# Altium project LimeSDR-QPCIe_1v2.PrjPcb (part 8 of 13)

## Sheet 22_USB3_0_device.SchDoc: USB3.0 device
size A3; Organization: Lime Microsystems; Address1: Surrey Tech Centre; Address2: Guildford GU2 7YG; Address3: Surrey; Address4: United Kingdom; Revision: v1.2; SheetNumber: 20; SheetTotal: 27
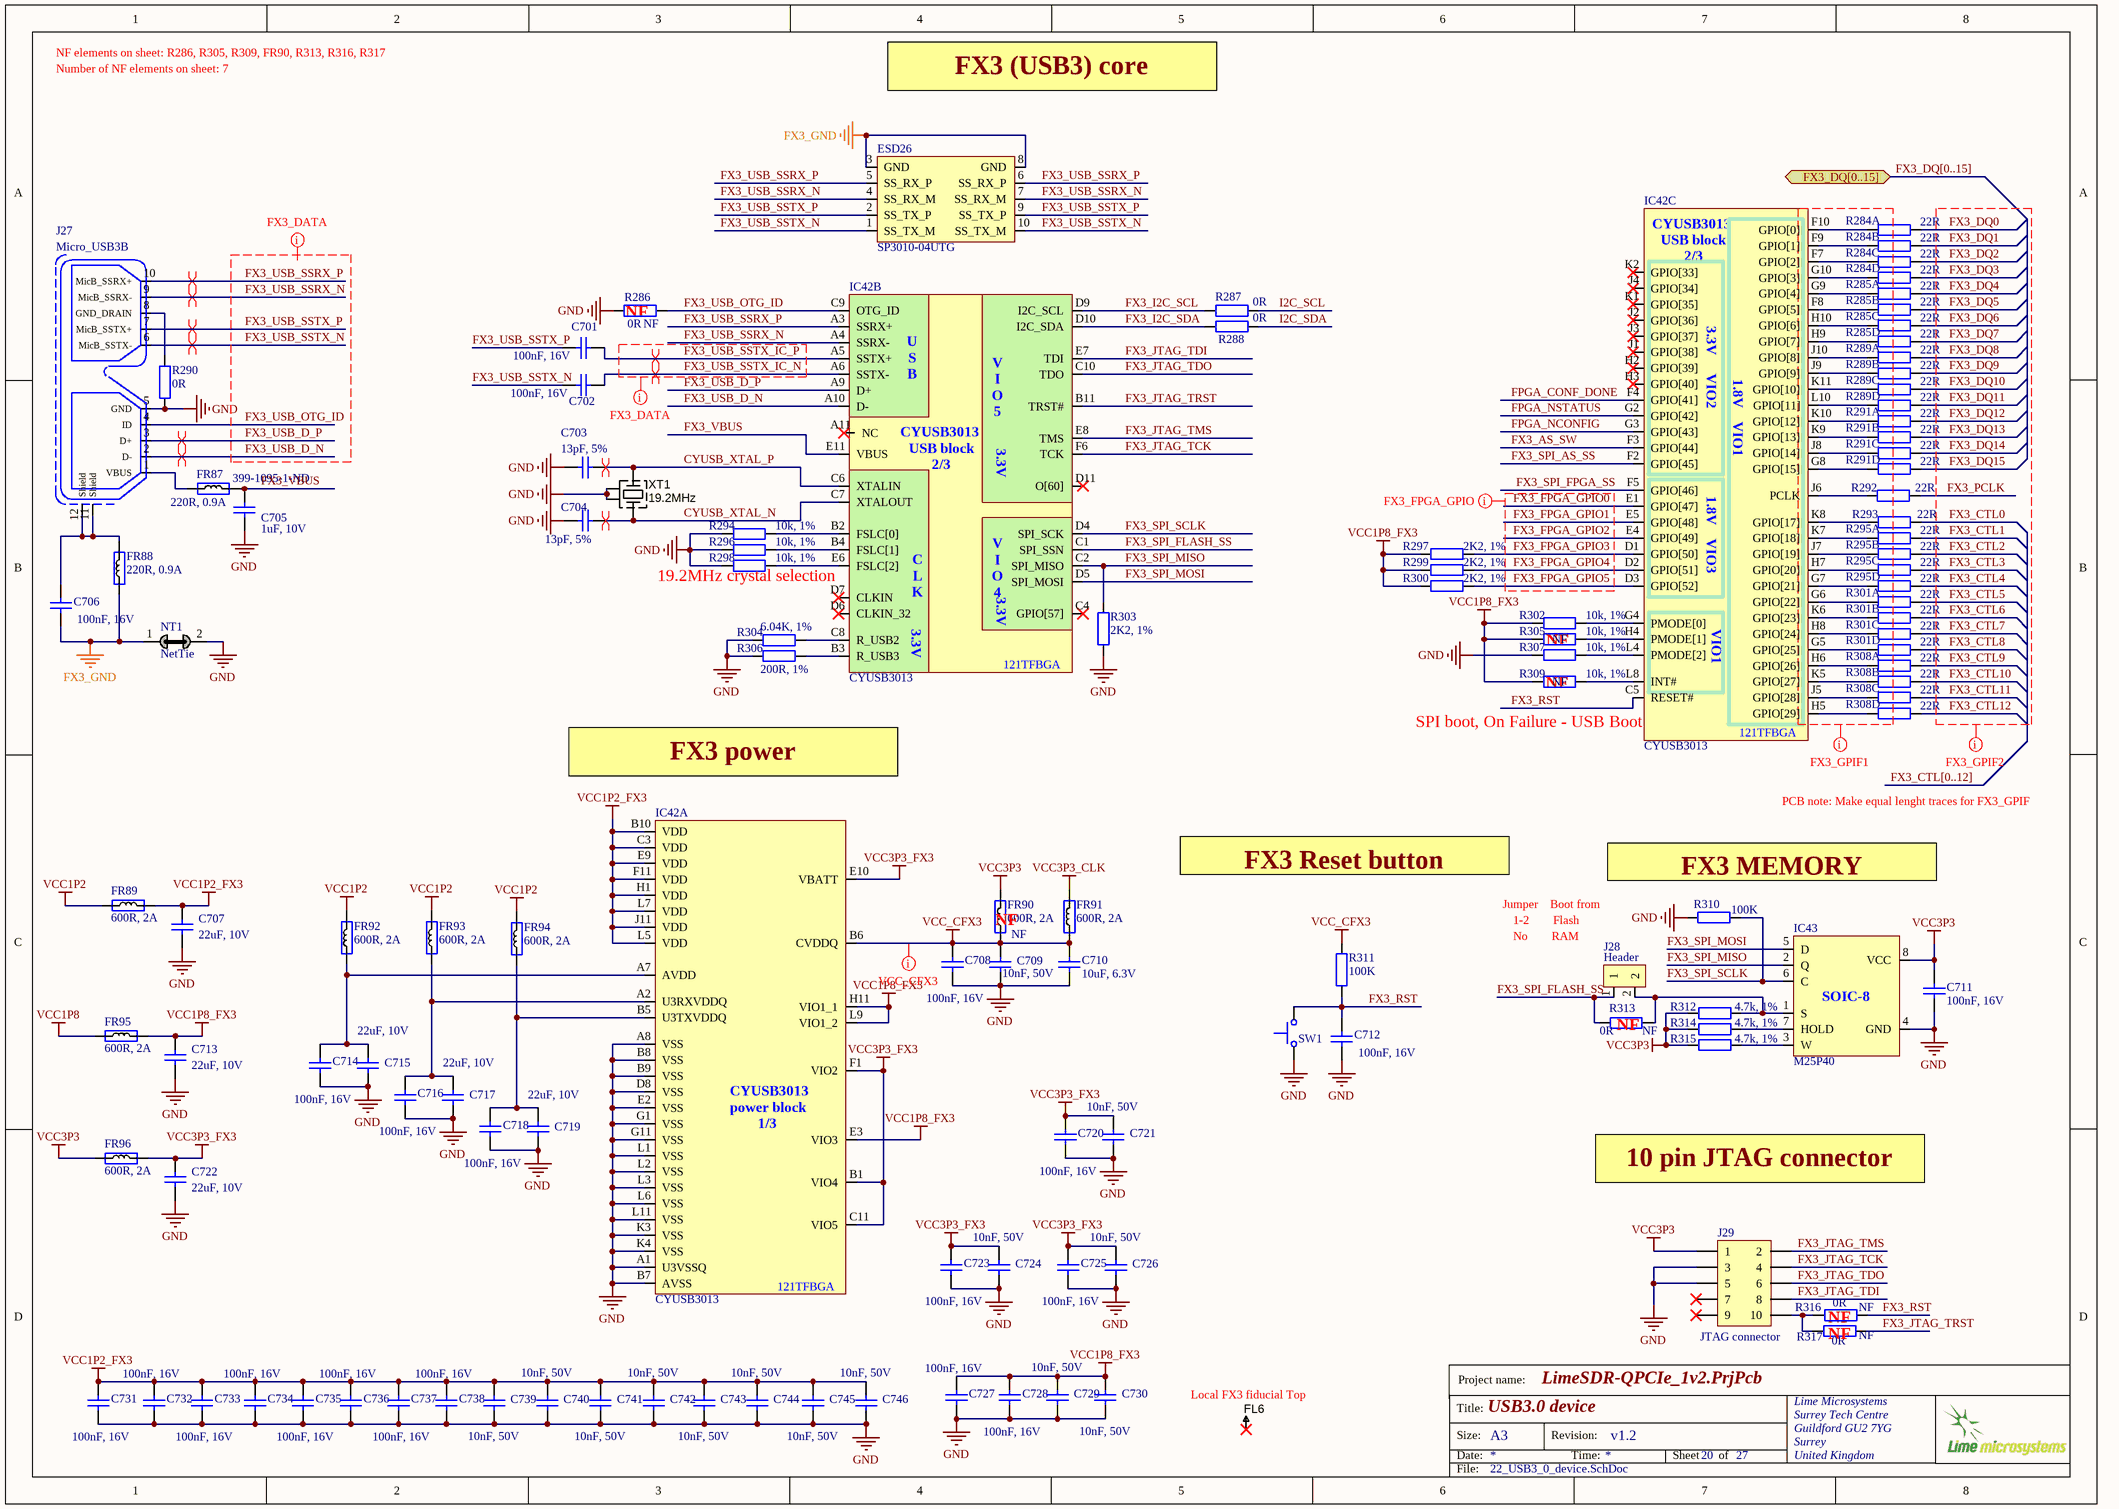
[diagram p21: 22_USB3_0_device.SchDoc]

### Parts
C701  100nF, 16V  [CAP0402]
C702  100nF, 16V  [CAP0402]
C703  13pF, 5%  [CAP0402]
C704  13pF, 5%  [CAP0402]
C705  1uF, 10V  Supplier Part Number 1: 399-1095-1-ND  [CAP0603]
C706  100nF, 16V  [CAP0402]
C707  22uF, 10V  [CAP0603]
C708  100nF, 16V  [CAP0402]
C709  10nF, 50V  [CAP0402]
C710  10uF, 6.3V  [CAP0603]
C711  100nF, 16V  [CAP0402]
C712  100nF, 16V  [CAP0402]
C713  22uF, 10V  [CAP0603]
C714  100nF, 16V  [CAP0402]
C715  22uF, 10V  [CAP0603]
C716  100nF, 16V  [CAP0402]
C717  22uF, 10V  [CAP0603]
C718  100nF, 16V  [CAP0402]
C719  22uF, 10V  [CAP0603]
C720  100nF, 16V  [CAP0402]
C721  10nF, 50V  [CAP0402]
C722  22uF, 10V  [CAP0603]
C723  100nF, 16V  [CAP0402]
C724  10nF, 50V  [CAP0402]
C725  100nF, 16V  [CAP0402]
C726  10nF, 50V  [CAP0402]
C727  100nF, 16V  [CAP0402]
C728  100nF, 16V  [CAP0402]
C729  10nF, 50V  [CAP0402]
C730  10nF, 50V  [CAP0402]
C731  100nF, 16V  [CAP0402]
C732  100nF, 16V  [CAP0402]
C733  100nF, 16V  [CAP0402]
C734  100nF, 16V  [CAP0402]
C735  100nF, 16V  [CAP0402]
C736  100nF, 16V  [CAP0402]
C737  100nF, 16V  [CAP0402]
C738  100nF, 16V  [CAP0402]
C739  10nF, 50V  [CAP0402]
C740  10nF, 50V  [CAP0402]
C741  10nF, 50V  [CAP0402]
C742  10nF, 50V  [CAP0402]
C743  10nF, 50V  [CAP0402]
C744  10nF, 50V  [CAP0402]
C745  10nF, 50V  [CAP0402]
C746  10nF, 50V  [CAP0402]
ESD26  SP3010-04UTG  [SP3010-04UTG]
FL6  Fiducial  [Fiducial_local]  (value not drawn)
FR87  220R, 0.9A  [RES0402]
FR88  220R, 0.9A  [RES0402]
FR89  600R, 2A  [RES0805]
FR90  600R, 2A  Assembly Info: NF  [RES0805]
FR91  600R, 2A  [RES0805]
FR92  600R, 2A  [RES0805]
FR93  600R, 2A  [RES0805]
FR94  600R, 2A  [RES0805]
FR95  600R, 2A  [RES0805]
FR96  600R, 2A  [RES0805]
IC42  CYUSB3013  [CYUSB3013]  (parts A,B,C of 3)
IC43  M25P40  [M25P40-VMN6TPB_SO8N]
J27  Micro_USB3B  [microUSB3B_SM_v2]
J28  Header  [HDR_1x2]
J29  JTAG connector  [SWD_10_pin]
NT1  NetTie  [NetTie_Wide2]  (net tie, no BOM)
R284  22R  [ChipResistorArray]  (parts A,B,C,D of 4)
R285  22R  [ChipResistorArray]  (parts A,B,C,D of 4)
R286  0R  Assembly Info: NF  [RES0402]
R287  0R  [RES0402]
R288  0R  [RES0402]
R289  22R  [ChipResistorArray]  (parts A,B,C,D of 4)
R290  0R  [RES0402]
R291  22R  [ChipResistorArray]  (parts A,B,C,D of 4)
R292  22R  [RES0402]
R293  22R  [RES0402]
R294  10k, 1%  [RES0402]
R295  22R  [ChipResistorArray]  (parts A,B,C,D of 4)
R296  10k, 1%  [RES0402]
R297  2K2, 1%  [RES0402]
R298  10k, 1%  [RES0402]
R299  2K2, 1%  [RES0402]
R300  2K2, 1%  [RES0402]
R301  22R  [ChipResistorArray]  (parts A,B,C,D of 4)
R302  10k, 1%  [RES0402]
R303  2K2, 1%  [RES0402]
R304  6.04K, 1%  [RES0402]
R305  10k, 1%  Assembly Info: NF  [RES0402]
R306  200R, 1%  [RES0402]
R307  10k, 1%  [RES0402]
R308  22R  [ChipResistorArray]  (parts A,B,C,D of 4)
R309  10k, 1%  Assembly Info: NF  [RES0402]
R310  100K  [RES0402]
R311  100K  [RES0402]
R312  4.7k, 1%  [RES0402]
R313  0R  Assembly Info: NF  [RES0402]
R314  4.7k, 1%  [RES0402]
R315  4.7k, 1%  [RES0402]
R316  0R  Assembly Info: NF  [RES0402]
R317  0R  Assembly Info: NF  [RES0402]
SW1  Switch, tactile  [SW_tactile]  (value not drawn)
XT1  19.2MHz  [CRYSTAL_4-LCC_v2]

### Ports
FX3_DQ[0..15] (bidir)

### Nets
FX3_GND: C706.2 ESD26.3(GND) ESD26.8(GND) FR88.1 NT1.1
GND: C703.1 C704.1 C705.1 C707.1 C708.2 C709.1 C710.1 C711.2 C712.2 C713.1 C714.2 C715.1 C716.2 C717.1 C718.2 C719.1 C720.2 C721.1 C722.1 C723.2 C724.1 C725.2 C726.1 C727.2 C728.2 C729.1 C730.1 C731.2 C732.2 C733.2 C734.2 C735.2 C736.2 C737.2 C738.2 C739.1 C740.1 C741.1 C742.1 C743.1 C744.1 C745.1 C746.1 IC42.A1(U3VSSQ) IC42.A8(VSS) IC42.B7(AVSS) IC42.B8(VSS) IC42.B9(VSS) IC42.D8(VSS) IC42.E2(VSS) IC42.G1(VSS) IC42.G11(VSS) IC42.K3(VSS) IC42.K4(VSS) IC42.L1(VSS) IC42.L2(VSS) IC42.L3(VSS) IC42.L6(VSS) IC42.L11(VSS) IC43.4(GND) J27.5(GND) J29.3 J29.5 NT1.2 R286.1 R290.1 R294.2 R296.2 R298.2 R303.2 R304.1 R306.1 R307.2 R310.1 SW1.1 XT1.2(GND) XT1.4(GND)
VCC1P2: FR89.1 FR92.2 FR93.2 FR94.2
VCC1P2_FX3: C707.2 C731.1 C732.1 C733.1 C734.1 C735.1 C736.1 C737.1 C738.1 C739.2 C740.2 C741.2 C742.2 C743.2 C744.2 C745.2 C746.2 FR89.2 IC42.B10(VDD) IC42.C3(VDD) IC42.E9(VDD) IC42.F11(VDD) IC42.H1(VDD) IC42.J11(VDD) IC42.L5(VDD) IC42.L7(VDD)
VCC1P8: FR95.1
VCC1P8_FX3: C713.2 C727.1 C728.1 C729.2 C730.2 FR95.2 IC42.E3(VIO3) IC42.H11(VIO1_1) IC42.L9(VIO1_2) R297.1 R299.1 R300.1 R302.2 R305.2 R309.2
VCC3P3: C711.1 FR90.2 FR96.1 IC43.8(VCC) J29.1 R312.2 R314.2 R315.2
VCC3P3_CLK: FR91.2
VCC3P3_FX3: C720.1 C721.2 C722.2 C723.1 C724.2 C725.1 C726.2 FR96.2 IC42.B1(VIO4) IC42.C11(VIO5) IC42.E10(VBATT) IC42.F1(VIO2)
VCC_CFX3: C708.1 C709.2 C710.2 FR90.1 FR91.1 IC42.B6(CVDDQ) R311.1
CYUSB_XTAL_N: C704.2 IC42.C7(XTALOUT) XT1.3(X)
CYUSB_XTAL_P: C703.2 IC42.C6(XTALIN) XT1.1(X)
FPGA_CONF_DONE: IC42.F4(GPIO[41])
FPGA_NCONFIG: IC42.G3(GPIO[43])
FPGA_NSTATUS: IC42.G2(GPIO[42])
FX3_AS_SW: IC42.F3(GPIO[44])
FX3_CTL0: R293.2
FX3_CTL1: R295.2
FX3_CTL2: R295.4
FX3_CTL3: R295.6
FX3_CTL4: R295.8
FX3_CTL5: R301.2
FX3_CTL6: R301.4
FX3_CTL7: R301.6
FX3_CTL8: R301.8
FX3_CTL9: R308.2
FX3_CTL10: R308.4
FX3_CTL11: R308.6
FX3_CTL12: R308.8
FX3_DQ0: R284.2
FX3_DQ1: R284.4
FX3_DQ2: R284.6
FX3_DQ3: R284.8
FX3_DQ4: R285.2
FX3_DQ5: R285.4
FX3_DQ6: R285.6
FX3_DQ7: R285.8
FX3_DQ8: R289.2
FX3_DQ9: R289.4
FX3_DQ10: R289.6
FX3_DQ11: R289.8
FX3_DQ12: R291.2
FX3_DQ13: R291.4
FX3_DQ14: R291.6
FX3_DQ15: R291.8
FX3_FPGA_GPIO0: IC42.E1(GPIO[47])
FX3_FPGA_GPIO1: IC42.E5(GPIO[48])
FX3_FPGA_GPIO2: IC42.E4(GPIO[49])
FX3_FPGA_GPIO3: IC42.D1(GPIO[50]) R297.2
FX3_FPGA_GPIO4: IC42.D2(GPIO[51]) R299.2
FX3_FPGA_GPIO5: IC42.D3(GPIO[52]) R300.2
FX3_I2C_SCL: IC42.D9(I2C_SCL) R287.2
FX3_I2C_SDA: IC42.D10(I2C_SDA) R288.2
FX3_JTAG_TCK: IC42.F6(TCK) J29.4
FX3_JTAG_TDI: IC42.E7(TDI) J29.8
FX3_JTAG_TDO: IC42.C10(TDO) J29.6
FX3_JTAG_TMS: IC42.E8(TMS) J29.2
FX3_JTAG_TRST: IC42.B11(TRST#) R317.1
FX3_PCLK: R292.2
FX3_RST: C712.1 IC42.C5(RESET#) R311.2 R316.1 SW1.2
FX3_SPI_AS_SS: IC42.F2(GPIO[45])
FX3_SPI_FLASH_SS: IC42.C1(SPI_SSN) J28.1 R313.1
FX3_SPI_FPGA_SS: IC42.F5(GPIO[46])
FX3_SPI_MISO: IC42.C2(SPI_MISO) IC43.2(Q) R303.1
FX3_SPI_MOSI: IC42.D5(SPI_MOSI) IC43.5(D)
FX3_SPI_SCLK: IC42.D4(SPI_SCK) IC43.6(C) R310.2
FX3_USB_D_N: IC42.A10(D-) J27.2(D-)
FX3_USB_D_P: IC42.A9(D+) J27.3(D+)
FX3_USB_OTG_ID: IC42.C9(OTG_ID) J27.4(ID) R286.2
FX3_USB_SSRX_N: ESD26.4(SS_RX_M) ESD26.7(SS_RX_M) IC42.A4(SSRX-) J27.9(MicB_SSRX-)
FX3_USB_SSRX_P: ESD26.5(SS_RX_P) ESD26.6(SS_RX_P) IC42.A3(SSRX+) J27.10(MicB_SSRX+)
FX3_USB_SSTX_IC_N: C702.2 IC42.A6(SSTX-)
FX3_USB_SSTX_IC_P: C701.1 IC42.A5(SSTX+)
FX3_USB_SSTX_N: C702.1 ESD26.1(SS_TX_M) ESD26.10(SS_TX_M) J27.6(MicB_SSTX-)
FX3_USB_SSTX_P: C701.2 ESD26.2(SS_TX_P) ESD26.9(SS_TX_P) J27.7(MicB_SSTX+)
FX3_VBUS: C705.2 FR87.2 IC42.E11(VBUS)
I2C_SCL: R287.1
I2C_SDA: R288.1
NetC706_1: C706.1 FR88.2 J27.11(Shield) J27.12(Shield)
NetC714_1: C714.1 C715.2 FR92.1 IC42.A7(AVDD)
NetC716_1: C716.1 C717.2 FR93.1 IC42.A2(U3RXVDDQ)
NetC718_1: C718.1 C719.2 FR94.1 IC42.B5(U3TXVDDQ)
NetFR87_1: FR87.1 J27.1(VBUS)
NetIC42_B2: IC42.B2(FSLC[0]) R294.1
NetIC42_B3: IC42.B3(R_USB3) R306.2
NetIC42_B4: IC42.B4(FSLC[1]) R296.1
NetIC42_C8: IC42.C8(R_USB2) R304.2
NetIC42_E6: IC42.E6(FSLC[2]) R298.1
NetIC42_F7: IC42.F7(GPIO[2]) R284.5
NetIC42_F8: IC42.F8(GPIO[5]) R285.3
NetIC42_F9: IC42.F9(GPIO[1]) R284.3
NetIC42_F10: IC42.F10(GPIO[0]) R284.1
NetIC42_G4: IC42.G4(PMODE[0]) R302.1
NetIC42_G5: IC42.G5(GPIO[25]) R301.7
NetIC42_G6: IC42.G6(GPIO[22]) R301.1
NetIC42_G7: IC42.G7(GPIO[21]) R295.7
NetIC42_G8: IC42.G8(GPIO[15]) R291.7
NetIC42_G9: IC42.G9(GPIO[4]) R285.1
NetIC42_G10: IC42.G10(GPIO[3]) R284.7
NetIC42_H4: IC42.H4(PMODE[1]) R305.1
NetIC42_H5: IC42.H5(GPIO[29]) R308.7
NetIC42_H6: IC42.H6(GPIO[26]) R308.1
NetIC42_H7: IC42.H7(GPIO[20]) R295.5
NetIC42_H8: IC42.H8(GPIO[24]) R301.5
NetIC42_H9: IC42.H9(GPIO[7]) R285.7
NetIC42_H10: IC42.H10(GPIO[6]) R285.5
NetIC42_J5: IC42.J5(GPIO[28]) R308.5
NetIC42_J6: IC42.J6(PCLK) R292.1
NetIC42_J7: IC42.J7(GPIO[19]) R295.3
NetIC42_J8: IC42.J8(GPIO[14]) R291.5
NetIC42_J9: IC42.J9(GPIO[9]) R289.3
NetIC42_J10: IC42.J10(GPIO[8]) R289.1
NetIC42_K5: IC42.K5(GPIO[27]) R308.3
NetIC42_K6: IC42.K6(GPIO[23]) R301.3
NetIC42_K7: IC42.K7(GPIO[18]) R295.1
NetIC42_K8: IC42.K8(GPIO[17]) R293.1
NetIC42_K9: IC42.K9(GPIO[13]) R291.3
NetIC42_K10: IC42.K10(GPIO[12]) R291.1
NetIC42_K11: IC42.K11(GPIO[10]) R289.5
NetIC42_L4: IC42.L4(PMODE[2]) R307.1
NetIC42_L8: IC42.L8(INT#) R309.1
NetIC42_L10: IC42.L10(GPIO[11]) R289.7
NetIC43_1: IC43.1(S) J28.2 R312.1 R313.2
NetIC43_3: IC43.3(W) R315.1
NetIC43_7: IC43.7(HOLD) R314.1
NetJ27_8: J27.8(GND_DRAIN) R290.2
NetJ29_10: J29.10 R316.2 R317.2

Not connected (* = marked no-connect by the designer): FL6 1*; IC42 A11(NC)* C4(GPIO[57])* D6(CLKIN_32)* D7(CLKIN)* D11(O[60])* H2(GPIO[39])* H3(GPIO[40])* J1(GPIO[38])* J2(GPIO[36])* J3(GPIO[37])* J4(GPIO[34])* K1(GPIO[35])* K2(GPIO[33])*; J29 7* 9*

### Buses and harness runs
bus FX3_CTL[0..12]
bus FX3_DQ[0..15] = port FX3_DQ[0..15]

### Layout directives
differential pair: CYUSB_XTAL_N, CYUSB_XTAL_P, FX3_USB_D_N, FX3_USB_D_P, FX3_USB_SSRX_N, FX3_USB_SSRX_P, FX3_USB_SSTX_IC_N, FX3_USB_SSTX_IC_P, FX3_USB_SSTX_N, FX3_USB_SSTX_P
net class FX3_DATA: FX3_USB_D_N, FX3_USB_D_P, FX3_USB_OTG_ID, FX3_USB_SSRX_N, FX3_USB_SSRX_P, FX3_USB_SSTX_IC_N, FX3_USB_SSTX_IC_P, FX3_USB_SSTX_N, FX3_USB_SSTX_P
net class FX3_GPIF1: (no net found under the mark)
net class FX3_FPGA_GPIO: FX3_FPGA_GPIO0, FX3_FPGA_GPIO1, FX3_FPGA_GPIO2, FX3_FPGA_GPIO3, FX3_FPGA_GPIO4, FX3_FPGA_GPIO5
net class FX3_GPIF2: FX3_CTL0, FX3_CTL1, FX3_CTL2, FX3_CTL3, FX3_CTL4, FX3_CTL5, FX3_CTL6, FX3_CTL7, FX3_CTL8, FX3_CTL9, FX3_CTL10, FX3_CTL11, FX3_CTL12, FX3_DQ0, FX3_DQ1, FX3_DQ2, FX3_DQ3, FX3_DQ4, FX3_DQ5, FX3_DQ6, FX3_DQ7, FX3_DQ8, FX3_DQ9, FX3_DQ10, FX3_DQ11, FX3_DQ12, FX3_DQ13, FX3_DQ14, FX3_DQ15, FX3_PCLK
net class VCC_CFX3: VCC_CFX3

### Notes on the sheet
- NF elements on sheet: R286, R305, R309, FR90, R313, R316, R317
- Number of NF elements on sheet: 7
- FX3 (USB3) core
- (near R286) NF
- (near IC42) VIO2
- (near IC42) 3.3V
- (near IC42) 1.8V
- (near IC42) VIO1
- 19.2MHz crystal selection
- (near IC42) VIO3
- (near R305) NF
- (near R309) NF
- FX3 power
- (near IC42) SPI boot, On Failure - USB Boot
- PCB note: Make equal lenght traces for FX3_GPIF
- (near FR90) NF
- FX3 Reset button
- Jumper    Boot from
- 1-2        Flash
- (near R310) FX3 MEMORY
- (near J28) No        RAM
- (near R313) NF
- 10 pin JTAG connector
- NF
- (near R317) NF
- (near FL6) Local FX3 fiducial Top
- Project name:
- Title:
- Size:
- Date:
- A3
- Revision:
- Time:
- Sheet
- of
- File:
- (in symbol CYUSB3013, part A) CYUSB3013 / power block / 1/3; 121TFBGA
- (in symbol CYUSB3013, part B) U / S / B; V / I / O / 5; CYUSB3013 / USB block / 2/3; C / L / K; V / I / O / 4; 121TFBGA
- (in symbol CYUSB3013, part C) CYUSB3013 / USB block / 2/3; 121TFBGA
- (in symbol M25P40) SOIC-8

### Library data of the parts
C701 C702 C706 C708 C711 C712 C714 C716 C718 C720 C723 C725 C727 C728 C731-C738 = Cap_0603: Part Description: 0.10µF ±10% 16V Ceramic Capacitor X7R 0402 (1005 Metric); Manufacturer Part Number 1: GRM155R71C104KA88D; Brand: Murata Electronics; Tolerance: 10 %; Type: General Purpose MLCC; Capacitance: 0.1 uF; Temperature Coefficient / Code: +/- 15 %; Case Height: 0.5 mm; Case Length: 1 mm; Dielectric: X7R; Supplier 1: Mouser; Supplier Part Number 1: 81-GRM155R71C104KA88; Case Code - in: 0402; Manufacturer: Murata Electronics; Category: Multilayer Ceramic Capacitors MLCC - SMD/SMT; Voltage Rating DC: 16 V; Value: 100nF, 16V; Case Code - mm: 1005; Case Width: 0.5 mm; Manufacturer Part Number: GRM155R71C104KA88D; Maximum Operating Temperature: + 125 C; Minimum Operating Temperature: - 55 C; Minimum Order Quantity: 1; Operating Temperature Range: - 55 C to + 125 C; Package / Case: 0402 (1005 metric); Packaging: Reel; Product: General Type MLCCs; Product Category: Low & Medium Capacitance SMD Ceramic Chip Capacitors; Reeling: True; RoHS - Mouser: Y; RoHS: RoHS Compliant; Series: GRM; Standard Pack Qty: 10000; Termination Style: SMD/SMT
C703 C704 = Cap_0603: Manufacturer: Murata Electronics North America; Manufacturer Part Number 1: GRM1555C1H130JA01D; Part Description: 13pF ±5% 50V Ceramic Capacitor C0G, NP0 0402 (1005 Metric); Capacitance: 13pF, 50V; Voltage - Rated: 50V; Supplier 1: Digi-Key; Supplier Part Number 1: 490-5925-2-ND; Tolerance: ±5%; Category: Capacitors; Package / Case: 0402 (1005 Metric); Value: 13pF, 5%
C705 = Cap_0603: Part Description: CAP CER 0.1UF 10V X7R 0603; Manufacturer: KEMET; Manufacturer Part Number 1: C0603C104K8RACTU; Capacitance: 0.1µF; Tolerance: ±10%; Temperature Coefficient: X7R; Supplier 1: Digi-Key; RoHS: RoHS Compliant; Category: Capacitors; Stock 1: 1223171; Pricing 1: 1=0.1, 10=0.028, 100=0.0125, 1000=0.00699 (USD); Packaging: Cut Tape (CT); Part Status: Active; Voltage - Rated: 10V; Operating Temperature: -55°C ~ 125°C; Features: -; Ratings: -; Applications: General Purpose; Failure Rate: -; Mounting Type: Surface Mount, MLCC; Package / Case: 0603 (1608 Metric); Size / Dimension: 0.063" L x 0.031" W (1.60mm x 0.80mm); Height - Seated (Max): -; Thickness (Max): 0.034" (0.87mm); Lead Spacing: -; Lead Style: -; ComponentLink1URL: http://www.kemet.com/docfinder?Partnumber=C0603C104K8RACTU; ComponentLink1Description: http://www.kemet.com/docfinder?Partnumber=C0603C104K8RACTU; value: 1uF, 10V
C707 C713 C715 C717 C719 C722 = Cap_0603: Manufacturer Part Number 1: C1608X5R1A226M080AC; Part Description: 22µF ±20% 10V Ceramic Capacitor X5R 0603 (1608 Metric); Manufacturer: TDK Corporation; Brand: TDK; Temperature Coefficient / Code: +/- 15 %; Tolerance: 20 %; Type: Multilayer Ceramic Chip Capacitor; Supplier 1: Mouser; Supplier Part Number 1: 810-C1608X5R1A226M; Package / Case: 0603 (1608 metric); Category: Multilayer Ceramic Capacitors MLCC - SMD/SMT; Capacitance: 22 uF; Operating Temperature Range: - 55 C to + 85 C; Case Code - in: 0603; Voltage Rating DC: 10 V; Case Code - mm: 1608; Value: 22uF, 10V
C709 C721 C724 C726 C729 C730 C739-C746 = Cap_0603: Part Description: 10000pF ±10% 50V Ceramic Capacitor X7R 0402 (1005 Metric); Manufacturer Part Number 1: CC0402KRX7R9BB103; Manufacturer: Yageo; Tolerance: ±10%; Capacitance: 10000pF; Supplier 1: Digi-Key; Supplier Part Number 1: 311-1349-2-ND; Category: Capacitors; Package / Case: 0402 (1005 Metric); Voltage - Rated: 50V; Value: 10nF, 50V
C710 = Cap_0603: Manufacturer Part Number 1: CC0603MRX5R5BB106; Part Description: 10µF ±20% 6.3V Ceramic Capacitor X5R 0603 (1608 Metric); Manufacturer: Yageo; Capacitance: 10µF; Tolerance: ±20%; Supplier 1: Digi-Key; Supplier Part Number 1: 311-1448-2-ND; Package / Case: 0603 (1608 Metric); Category: Capacitors; Voltage - Rated: 6.3V; Value: 10uF, 6.3V
ESD26 = SP3010-04UTG: Manufacturer: Littelfuse Inc; Part Description: TVS DIODE 6VWM 12.3VC UDFN; Supplier 1: Digi-Key; Category: Circuit Protection; Supplier Device Package: 10-µDFN (2.5x1.0); Supplier Part Number 1: F3507TR-ND; Manufacturer Part Number 1: SP3010-04UTG
FR87 = Ferrite: Manufacturer: TDK Corporation; Part Description: FERRITE BEAD 220 OHM 0402 1LN; Impedance @ Frequency: 220 Ohm @ 100MHz; Current Rating: 900mA; DC Resistance (DCR): 220 mOhm Max; Supplier 1: Digi-Key; Package / Case: 0402 (1005 Metric); Category: Filters; Supplier Part Number 1: 445-9329-2-ND; Value: 220R, 0.9A
FR88 = Ferrite: Manufacturer: TDK Corporation; Impedance @ Frequency: 220 Ohm @ 100MHz; Current Rating: 900mA; DC Resistance (DCR): 220 mOhm Max; Supplier 1: Digi-Key; Package / Case: 0402 (1005 Metric); Category: Filters; Supplier Part Number: 445-9329-2-ND; Value: 220R, 0.9A
FR89-FR96 = Ferrite: Manufacturer Part Number 1: MPZ2012S601A; Manufacturer: TDK; Part Description: FERRITE BEAD 600 OHM 0805 1LN; Impedance Tolerance: ± 25%; Impedance @ 100MHz: 600; Ferrite Mounting: SMD; DC Resistance Max: 0.1; DC Current Rating: 2; Ferrite Case Style: 0805 [2012 Metric]; DC Resistance (DCR): 100 mOhm Max; Filter Type: Differential Mode - Single; Impedance @ Frequency: 600 Ohm @ 100MHz; Supplier 1: Farnell; Supplier Part Number 1: 1669753RL; Supplier: Farnell; Core Material: Ferrite; Value: 600R, 2A; Category: Filters; Current Rating: 2A; Height (Max): 0.041" (1.05mm); Mounting Type: Surface Mount; Package / Case: 0805 (2012 Metric); Packaging: Tape & Reel (TR); RoHS: RoHS Compliant; Size / Dimension: 0.079" L x 0.049" W (2.00mm x 1.25mm)
IC42 = CYUSB3013: Cypress USB3.0 chip; Manufacturer Part Number 1: CYUSB3013-BZXC; Manufacturer: Cypress Semiconductor Corp; Part Description: IC ARM9 USB3 CONTROLLER 121FBGA; Voltage - Supply: 1.15 V ~ 1.25 V; Supplier 1: Digi-Key; Supplier Part Number 1: 428-3181-ND; Package / Case: 121-TFBGA
IC43 = M25P40: Manufacturer: Micron Technology Inc; Manufacturer Part Number 1: M25P40-VMN6TPB TR; Part Description: IC FLASH 4MBIT 75MHZ 8SO; Memory Size: 4M (512K x 8); Voltage - Supply: 2.3 V ~ 3.6 V; Supplier 1: Digi-Key; Supplier Device Package: 8-SO; Supplier: Digi-Key; Supplier Part Number 1: M25P40-VMN6TPBTR-ND
J27 = Micro_USB3_B: Manufacturer: Amphenol Commercial Products; Manufacturer Part Number 1: GSB443T33HR; Part Description: USB - micro B USB 3.1, Superspeed+ Receptacle Connector 10 Position Surface Mount, Right Angle, Horizontal; Connector Type: USB - micro B; Specifications: USB 3.1, Superspeed+; Gender: Receptacle; Number of Contacts: 10; Supplier 1: Digi-Key; Supplier Part Number 1: GSB443T33HRCT-ND; Category: Connectors, Interconnects; Features: Board Guide; Ingress Protection: -; RoHS: RoHS Compliant; Packaging: Cut Tape (CT); Mounting Type: Surface Mount, Right Angle, Horizontal
J28 = Jumper: Manufacturer Part Number 1: 961102-6404-AR; Part Description: 2 Positions Header, Unshrouded Connector 0.100" (2.54mm) Through Hole Gold; Manufacturer: 3M; Connector Type: Header, Unshrouded; Supplier 1: Digi-Key; Supplier Part Number 1: 3M9447-ND; Contact Type: Male Pin; Color: Black; Mounting Type: Through Hole; Category: Connectors, Interconnects; Contact Finish: Gold
J29 = Header 5X2_SWD: Header, 5-Pin, Dual row; Manufacturer Part Number 1: M50-3600542; Manufacturer: Harwin Inc; Part Description: 10 Position Header BTB Connector Gold 0.050" (1.27mm) Surface Mount; Number of Positions: 10; Molding Height Above Board: 0.039" (1.00mm); Row Spacing: 0.050" (1.27mm); Number of Positions Loaded: All; Connector Type: Unshrouded; Supplier 1: Digi-Key; Contact Mating Length: 0.118" (3.00mm); Category: Connectors, Interconnects; Color: Black; RoHS: RoHS Compliant; Number of Rows: 2; Contact Finish Thickness: 3µin (0.08µm); Height Stacking (Mating): -; Contact Finish: Gold; Termination: Solder; Mounting Type: Surface Mount; Pitch: 0.050" (1.27mm); Features: -; Packaging: Bulk; Supplier Part Number 1: 952-1389-ND
R284 R285 R289 R291 R295 R301 R308 = ResArray_0802: Part Description: RES ARRAY 4 RES 22 OHM 0804; Manufacturer Part Number 1: YC124-JR-0722RL; Manufacturer: Yageo; Temperature Coefficient: ±200ppm/°C; Tolerance: ±5%; Supplier 1: Digi-Key; Supplier Part Number 1: YC124J-22TR-ND; Package / Case: 0804, Convex, Long Side Terminals; Value: 22R
R286-R288 R290 = Res_0402: Manufacturer: Yageo; Part Description: RES SMD 0.0OHM JUMPER 1/16W 0402; Manufacturer Part Number 1: RC0402JR-070RL; Supplier 1: Digi-Key; Supplier Part Number 1: 311-0.0JRTR-ND; Composition: Thick Film; Package / Case: 0402 (1005 Metric); Category: Resistors; Value: 0R
R292 R293 = Res_0402: Part Description: RES SMD 22 OHM 1% 1/16W 0402; Manufacturer Part Number 1: RC0402FR-0722RL; Manufacturer: Yageo; Tolerance: ±1%; Temperature Coefficient: ±100ppm/°C; Resistance (Ohms): 22; Supplier 1: Digi-Key; Supplier Part Number 1: 311-22.0LRTR-ND; Supplier Device Package: 0402; Composition: Thick Film; Category: Resistors; Value: 22R
R294 R296 R298 R302 R305 R307 R309 = Res_0402: Manufacturer: Yageo; Manufacturer Part Number 1: RC0402FR-0710KL; Part Description: RES SMD 10K OHM 1% 1/16W 0402; Temperature Coefficient: ±100ppm/°C; Power (Watts): 0.063W, 1/16W; Value: 10k, 1%; Supplier 1: Digi-Key; Supplier Part Number 1: 311-10.0KLRTR-ND; Resistance (Ohms): 10k; Packaging: Tape & Reel (TR); RoHS: RoHS Compliant; Package / Case: 0402 (1005 Metric); Tolerance: ±1%; Operating Temperature: -55°C ~ 155°C; Size / Dimension: 0.039" L x 0.020" W (1.00mm x 0.50mm); Number of Terminations: 2; Category: Resistors; Height: 0.016" (0.40mm); Supplier Device Package: 0402; Features: Moisture Resistant; Composition: Thick Film
R297 R299 R300 R303 = Res_0402: Part Description: RES SMD 2.2K OHM 1% 1/16W 0402; Manufacturer Part Number 1: RMCF0402FT2K20; Resistance (Ohms): 2.2k; Temperature Coefficient: ±100ppm/°C; Supplier 1: Digi-Key; Supplier Part Number 1: RMCF0402FT2K20CT-ND; Height: 0.016" (0.40mm); Tolerance: ±1%; Composition: Thick Film; Package / Case: 0402 (1005 Metric); Category: Resistors; Value: 2K2, 1%
R304 = Res_0402: Manufacturer: Rohm Semiconductor; Manufacturer Part Number 1: MCR01MRTF6041; Part Description: RES SMD 6.04K OHM 1% 1/16W 0402; Temperature Coefficient: ±100ppm/°C; Supplier Part Number 1: RHM6.04KCDTR-ND; Supplier 1: Digi-Key; Category: Resistors; Supplier Device Package: 0402 (1005 Metric); Composition: Thick Film; Tolerance: ±1%; Value: 6.04K, 1%
R306 = Res_0402: Manufacturer: Stackpole Electronics Inc; Part Description: RES SMD 200 OHM 1% 1/16W 0402; Power (Watts): 0.063W, 1/16W; Resistance (Ohms): 200; Temperature Coefficient: ±100ppm/°C; Supplier 1: Digi-Key; Supplier Device Package: 0402; Composition: Thick Film; Category: Resistors; Tolerance: ±1%; Supplier Part Number 1: RMCF0402FT200RDKR-ND; Value: 200R, 1%
R310 = Res_0402: Manufacturer Part Number 1: ERJ-2GEJ104X; Manufacturer: Panasonic Electronic Components; Part Description: RES SMD 100K OHM 5% 1/10W 0402; Power (Watts): 0.1W, 1/10W; Tolerance: ±5%; Temperature Coefficient: ±200ppm/°C; Supplier 1: Digi-Key; Composition: Thick Film; Package / Case: 0402 (1005 Metric); Resistance (Ohms): 100k; Category: Resistors; Supplier Part Number 1: P100KJCT-ND; Value: 100K; Features: Automotive AEC-Q200; Height: 0.016" (0.40mm); Number of Terminations: 2; Operating Temperature: -55°C ~ 155°C; Packaging: Cut Tape (CT); RoHS: RoHS Compliant; Size / Dimension: 0.039" L x 0.020" W (1.00mm x 0.50mm); Supplier Device Package: 0402
R311 = Res_0402: Manufacturer: Panasonic Electronic Components; Manufacturer Part Number 1: ERJ-2GEJ104X; Part Description: RES SMD 100K OHM 5% 1/10W 0402; Power (Watts): 0.1W, 1/10W; Tolerance: ±5%; Temperature Coefficient: ±200ppm/°C; Supplier 1: Digi-Key; Composition: Thick Film; Package / Case: 0402 (1005 Metric); Resistance (Ohms): 100k; Category: Resistors; Supplier Part Number 1: P100KJCT-ND; Value: 100K; Features: Automotive AEC-Q200; Height: 0.016" (0.40mm); Number of Terminations: 2; Operating Temperature: -55°C ~ 155°C; Packaging: Cut Tape (CT); RoHS: RoHS Compliant; Size / Dimension: 0.039" L x 0.020" W (1.00mm x 0.50mm); Supplier Device Package: 0402
R312 R314 R315 = Res_0402: Manufacturer: Yageo; Part Description: RES SMD 4.7K OHM 1% 1/16W 0402; Manufacturer Part Number1: RC0402FR-074K7L; Temperature Coefficient: ±100ppm/°C; Power (Watts): 0.063W, 1/16W; Number of Terminations: 2; Category: Resistors; Supplier 1: Digi-Key; Height: 0.016" (0.40mm); Features: Moisture Resistant; Size / Dimension: 0.039" L x 0.020" W (1.00mm x 0.50mm); Supplier Device Package: 0402; RoHS: RoHS Compliant; Composition: Thick Film; Package / Case: 0402 (1005 Metric); Resistance (Ohms): 4.7k; Operating Temperature: -55°C ~ 155°C; Tolerance: ±1%; Supplier Part Number 1: 311-4.7KLRCT-ND; Packaging: Cut Tape (CT); Value: 4.7k, 1%
R313 R316 R317 = Res_0402: Manufacturer Part Number 1: RC0402JR-070RL; Manufacturer: Yageo; Part Description: RES SMD 0.0OHM JUMPER 1/16W 0402; Resistance (Ohms): 0.0; Tolerance: Jumper; Power (Watts): 0.063W, 1/16W; Value: 0R; Supplier 1: Digi-Key; Supplier Part Number 1: 311-0.0JRTR-ND; Category: Resistors; Temperature Coefficient: -; Features: Moisture Resistant; Supplier Device Package: 0402; Height: 0.016" (0.40mm); Package / Case: 0402 (1005 Metric); Operating Temperature: -55°C ~ 155°C; Size / Dimension: 0.039" L x 0.020" W (1.00mm x 0.50mm); Composition: Thick Film; Packaging: Tape & Reel (TR); Number of Terminations: 2; RoHS: RoHS Compliant
SW1 = Button: Part Description: Tactile Switch SPST-NO Top Actuated Surface Mount; Manufacturer Part Number 1: B3U-1000P; Manufacturer: Omron Electronics Inc-EMC Div; Outline: 3.00mm x 2.50mm; Actuator Type: Standard; Mechanical Life: 200,000 Cycles; Actuator Orientation: Top Actuated; Supplier 1: Digi-Key; Supplier Part Number 1: SW1020TR-ND; Category: Switches
XT1 = CRYSTAL_19M2: Oscillator Crystal 19.2 MHz; Manufacturer Part Number 1: 405C35B19M20000; Manufacturer: CTS-Frequency Controls; Part Description: 19.2MHz ±30ppm Crystal 13pF 60 Ohm -20°C ~ 70°C Surface Mount 4-SMD, No Lead (DFN, LCC); Frequency Tolerance: ±30ppm; ESR (Equivalent Series Resistance): 60 Ohm; Load Capacitance: 13pF; Frequency Stability: ±50ppm; Operating Mode: Fundamental; Supplier 1: Digi-Key; Supplier Part Number 1: CTX648CT-ND; Height: 0.041" (1.05mm); Category: Crystals and Oscillators; Package / Case: 4-SMD, No Lead (DFN, LCC); Mounting Type: Surface Mount; Operating Temperature: -20°C ~ 70°C; Size / Dimension: 0.197" L x 0.126" W (5.00mm x 3.20mm); Frequency: 19.2MHz

## Sheet 23_PCIe.SchDoc: PCI Express x4
size A4; Organization: Lime Microsystems; Address1: Surrey Tech Centre; Address2: Guildford GU2 7YG; Address3: Surrey; Address4: United Kingdom; Revision: v1.2; SheetNumber: 21; SheetTotal: 27
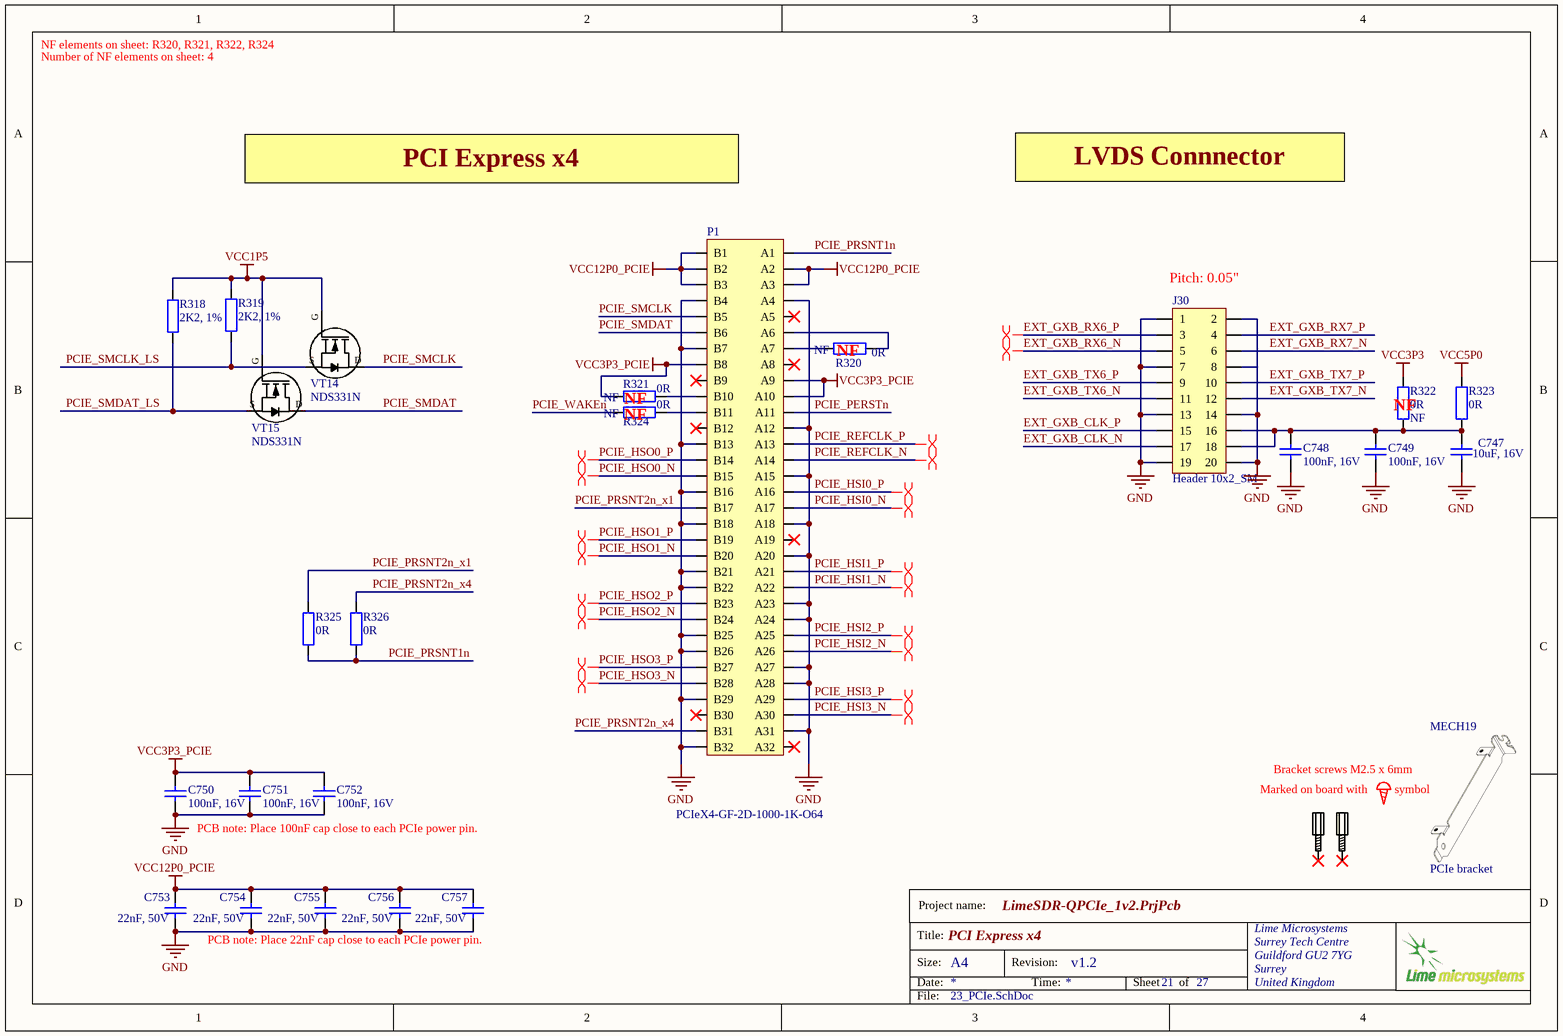
[diagram p22: 23_PCIe.SchDoc]

### Parts
C747  10uF, 16V  [CAP0603]
C748  100nF, 16V  [CAP0402]
C749  100nF, 16V  [CAP0402]
C750  100nF, 16V  [CAP0402]
C751  100nF, 16V  [CAP0402]
C752  100nF, 16V  [CAP0402]
C753  22nF, 50V  [CAP0402]
C754  22nF, 50V  [CAP0402]
C755  22nF, 50V  [CAP0402]
C756  22nF, 50V  [CAP0402]
C757  22nF, 50V  [CAP0402]
J30  Header 10x2_SM  [HEADER_10x2_SM_HALF_PITCH]
MECH19  PCIe bracket  [PCIe_bracket]
MECH20  Spacer M3  [PCIe_bracket_screw_M2.5]  (value not drawn)
MECH21  Spacer M3  [PCIe_bracket_screw_M2.5]  (value not drawn)
P1  PCIeX4-GF-2D-1000-1K-O64  [PCIeX4-GF-2D-1000-1K-O64]  (no BOM)
R318  2K2, 1%  [RES0402]
R319  2K2, 1%  [RES0402]
R320  0R  Assembly Info: NF  [RES0402]
R321  0R  Assembly Info: NF  [RES0402]
R322  0R  Assembly Info: NF  [RES0402]
R323  0R  [RES0402]
R324  0R  Assembly Info: NF  [RES0402]
R325  0R  [RES0402]
R326  0R  [RES0402]
VT14  NDS331N  [SOT23-3]
VT15  NDS331N  [SOT23-3]

### Nets
GND: C747.1 C748.2 C749.2 C750.2 C751.2 C752.2 C753.2 C754.2 C755.2 C756.2 C757.2 J30.1 J30.2 J30.7 J30.8 J30.13 J30.14 J30.19 J30.20 P1.A4 P1.A12 P1.A15 P1.A18 P1.A20 P1.A23 P1.A24 P1.A27 P1.A28 P1.A31 P1.B4 P1.B7 P1.B13 P1.B16 P1.B18 P1.B21 P1.B22 P1.B25 P1.B26 P1.B29 P1.B32
VCC1P5: R318.1 R319.1 VT14.G VT15.G
VCC3P3: R322.1
VCC3P3_PCIE: C750.1 C751.1 C752.1 P1.A9 P1.A10 P1.B8 R321.1
VCC5P0: R323.1
VCC12P0_PCIE: C753.1 C754.1 C755.1 C756.1 C757.1 P1.A2 P1.A3 P1.B1 P1.B2 P1.B3
EXT_GXB_CLK_N: J30.17
EXT_GXB_CLK_P: J30.15
EXT_GXB_RX6_N: J30.5
EXT_GXB_RX6_P: J30.3
EXT_GXB_RX7_N: J30.6
EXT_GXB_RX7_P: J30.4
EXT_GXB_TX6_N: J30.11
EXT_GXB_TX6_P: J30.9
EXT_GXB_TX7_N: J30.12
EXT_GXB_TX7_P: J30.10
PCIE_HSI0_N: P1.A17
PCIE_HSI0_P: P1.A16
PCIE_HSI1_N: P1.A22
PCIE_HSI1_P: P1.A21
PCIE_HSI2_N: P1.A26
PCIE_HSI2_P: P1.A25
PCIE_HSI3_N: P1.A30
PCIE_HSI3_P: P1.A29
PCIE_HSO0_N: P1.B15
PCIE_HSO0_P: P1.B14
PCIE_HSO1_N: P1.B20
PCIE_HSO1_P: P1.B19
PCIE_HSO2_N: P1.B24
PCIE_HSO2_P: P1.B23
PCIE_HSO3_N: P1.B28
PCIE_HSO3_P: P1.B27
PCIE_PERSTn: P1.A11
PCIE_PRSNT1n: P1.A1 R325.1 R326.1
PCIE_PRSNT2n_x1: P1.B17 R325.2
PCIE_PRSNT2n_x4: P1.B31 R326.2
PCIE_REFCLK_N: P1.A14
PCIE_REFCLK_P: P1.A13
PCIE_SMCLK: P1.B5 VT14.D
PCIE_SMCLK_LS: R319.2 VT14.S
PCIE_SMDAT: P1.B6 VT15.D
PCIE_SMDAT_LS: R318.2 VT15.S
PCIE_WAKEn: R324.1
NetC747_2: C747.2 C748.1 C749.1 J30.16 J30.18 R322.2 R323.2
NetP1_A6: P1.A6 R320.2
NetP1_A7: P1.A7 R320.1
NetP1_B10: P1.B10 R321.2
NetP1_B11: P1.B11 R324.2

Not connected (* = marked no-connect by the designer): MECH20 MH1*; MECH21 MH1*; P1 A5* A8* A19* A32* B9* B12* B30*

### Layout directives
differential pair: EXT_GXB_RX6_N, EXT_GXB_RX6_P, PCIE_HSI0_N, PCIE_HSI0_P, PCIE_HSI1_N, PCIE_HSI1_P, PCIE_HSI2_N, PCIE_HSI2_P, PCIE_HSI3_N, PCIE_HSI3_P, PCIE_HSO0_N, PCIE_HSO0_P, PCIE_HSO1_N, PCIE_HSO1_P, PCIE_HSO2_N, PCIE_HSO2_P, PCIE_HSO3_N, PCIE_HSO3_P, PCIE_REFCLK_N, PCIE_REFCLK_P

### Notes on the sheet
- NF elements on sheet: R320, R321, R322, R324
- Number of NF elements on sheet: 4
- PCI Express x4
- LVDS Connnector
- (near J30) Pitch: 0.05"
- (near R320) NF
- (near R324) NF
- (near R321) NF
- (near R322) NF
- (near MECH19) Bracket screws M2.5 x 6mm
- PCB note: Place 100nF cap close to each PCIe power pin.
- Marked on board with         symbol
- PCB note: Place 22nF cap close to each PCIe power pin.
- Project name:
- Title:
- Size:
- Date:
- A4
- Revision:
- Time:
- Sheet
- of
- File:

### Library data of the parts
C747 = Cap_0603: Manufacturer: Yageo; Manufacturer Part Number 1: GRM188R61C106MA73D; Part Description: 10µF ±20% 16V Ceramic Capacitor X5R 0603 (1608 Metric); Temperature Coefficient: X5R; Capacitance: 10µF; Tolerance: ±20%; Value: 10uF, 16V; Supplier 1: Digi-Key; Supplier Part Number 1: 490-7201-2-ND; Category: Capacitors; Ratings: -; Features: -; Lead Style: -; Package / Case: 0603 (1608 Metric); Lead Spacing: -; Applications: General Purpose; Voltage - Rated: 16V; Operating Temperature: -55°C ~ 85°C; Thickness (Max): 0.039" (1.00mm); Mounting Type: Surface Mount, MLCC; RoHS: RoHS Compliant; Size / Dimension: 0.063" L x 0.031" W (1.60mm x 0.80mm); Packaging: Tape & Reel (TR); Height - Seated (Max): -
C748 C749 = Cap_0603: Manufacturer Part Number 1: GRM155R71C104KA88D; Part Description: 0.10µF ±10% 16V Ceramic Capacitor X7R 0402 (1005 Metric); Brand: Murata Electronics; Tolerance: 10 %; Type: General Purpose MLCC; Capacitance: 0.1 uF; Temperature Coefficient / Code: +/- 15 %; Case Height: 0.5 mm; Case Length: 1 mm; Dielectric: X7R; Supplier 1: Mouser; Supplier Part Number 1: 81-GRM155R71C104KA88; Case Code - in: 0402; Manufacturer: Murata Electronics; Category: Multilayer Ceramic Capacitors MLCC - SMD/SMT; Voltage Rating DC: 16 V; Value: 100nF, 16V; Manufacturer Part Number: GRM155R71C104KA88D; Case Code - mm: 1005; Case Width: 0.5 mm; Maximum Operating Temperature: + 125 C; Minimum Operating Temperature: - 55 C; Minimum Order Quantity: 1; Operating Temperature Range: - 55 C to + 125 C; Package / Case: 0402 (1005 metric); Packaging: Reel; Product: General Type MLCCs; Product Category: Low & Medium Capacitance SMD Ceramic Chip Capacitors; Reeling: True; RoHS - Mouser: Y; RoHS: RoHS Compliant; Series: GRM; Standard Pack Qty: 10000; Termination Style: SMD/SMT
C750-C752 = Cap_0603: as C701 on sheet 22_USB3_0_device; Supplier 1: Mouser; Supplier Part Number 1: 81-GRM155R71C104KA88; Case Code - in: 0402; Manufacturer: Murata Electronics; Category: Multilayer Ceramic Capacitors MLCC - SMD/SMT; Voltage Rating DC: 16 V; Value: 100nF, 16V; Case Code - mm: 1005; Case Width: 0.5 mm; Manufacturer Part Number: GRM155R71C104KA88D; Maximum Operating Temperature: + 125 C; Minimum Operating Temperature: - 55 C; Minimum Order Quantity: 1; Operating Temperature Range: - 55 C to + 125 C; Package / Case: 0402 (1005 metric); Packaging: Reel; Product: General Type MLCCs; Product Category: Low & Medium Capacitance SMD Ceramic Chip Capacitors; Reeling: True; RoHS - Mouser: Y; RoHS: RoHS Compliant; Series: GRM; Standard Pack Qty: 10000; Termination Style: SMD/SMT
C753-C757 = Cap_0402: Manufacturer: Kemet; Manufacturer Part Number 1: C0402C223K5RACTU; Part Description: 0.022µF ±10% 50V Ceramic Capacitor X7R 0402 (1005 Metric); Temperature Coefficient: X7R; Tolerance: ±10%; Capacitance: 0.022µF; Value: 22nF, 50V; Supplier 1: Digi-Key; Supplier Part Number 1: 399-7780-1-ND; Ratings: -; Packaging: Cut Tape (CT); Category: Capacitors; Size / Dimension: 0.039" L x 0.020" W (1.00mm x 0.50mm); RoHS: RoHS Compliant; Operating Temperature: -55°C ~ 125°C; Mounting Type: Surface Mount, MLCC; Applications: General Purpose; Voltage - Rated: 50V; Thickness (Max): 0.022" (0.55mm); Features: -; Height - Seated (Max): -; Lead Style: -; Package / Case: 0402 (1005 Metric); Lead Spacing: -
J30 = Header 10x2_SM: Manufacturer: Amphenol FCI; Manufacturer Part Number 1: 20021121-00020C4LF; Part Description: 20 Positions Header Connector 0.050" (1.27mm) Surface Mount Gold; Pitch - Mating: 0.050" (1.27mm); Style: Board to Board; Shrouding: Unshrouded; Number of Positions: 20; Number of Positions Loaded: All; Contact Length - Mating: 0.120" (3.05mm); Material Flammability Rating: UL94 V-0; Supplier 1: Digi-Key; RoHS: RoHS Compliant; Category: Connectors, Interconnects; Stock 1: 7468; Pricing 1: 1=1.49, 10=1.351, 100=1.1582 (USD); Packaging: Cut Tape (CT); Part Status: Active; Connector Type: Header; Contact Type: Male Pin; Number of Rows: 2; Row Spacing - Mating: 0.050" (1.27mm); Mounting Type: Surface Mount; Termination: Solder; Fastening Type: Push-Pull; Contact Length - Post: -; Overall Contact Length: -; Insulation Height: -; Contact Shape: Square; Contact Finish - Mating: Gold; Contact Finish Thickness - Mating: 10µin (0.25µm); Contact Finish - Post: Tin; Contact Material: Copper Alloy; Insulation Material: Thermoplastic; Features: Pick and Place; Operating Temperature: -; Ingress Protection: -; Insulation Color: Black; Current Rating: -; Voltage Rating: -; Mated Stacking Heights: -; Contact Finish Thickness - Post: 50µin (1.27µm); Applications: -; ComponentLink1URL: http://portal.fciconnect.com/Comergent//fci/drawing/20021121.pdf; ComponentLink1Description: http://portal.fciconnect.com/Comergent//fci/drawing/20021121.pdf; Supplier Part Number 1: 609-3698-1-ND
MECH19 = PCIe_bracket: Manufacturer: Keystone Electronics; Manufacturer Part Number 1: 9203; Part Description: BRACKET, COMPUTER, PCI,LENGTH 120mm, HOLE TO HOLE DISTANCE 85.4mm; Card Type: PCI; Style: Blank; Supplier 1: Digi-Key; RoHS: RoHS Compliant; Category: Computers, Office - Components, Accessories; Stock 1: 5093; Pricing 1: 1=3.31, 10=2.083, 50=1.87, 100=1.785, 250=1.615, 1000=1.44, 2500=1.28001, 5000=1.1305 (USD); Part Status: Active; Material: Steel, Nickel Plated; ComponentLink1URL: http://www.keyelco.com/product-pdf.cfm?p=2468; ComponentLink1Description: http://www.keyelco.com/product-pdf.cfm?p=2468; Supplier Part Number 1: 36-9203-ND
MECH20 MECH21 = STANDOFF_M-F_THREADED_M3x8x10mm_HEX_5mm dia: STANDOFF M/F MET 5MM HEX 10MM L; Part Description: The M2.56 PRA2MCS100- is a M2.5 x 6mm Machine Screw, made of 18/8 stainless steel (A2 grade) with self colour finish, cross-recessed pan head Pozidriv head style. Designed according to DIN 7985 standard. Corrosion resistant under normal atmospheric conditions.; Manufacturer: DURATOOL; Manufacturer Part Number 1: M2.56 PRA2MCS100-; Thread Size - Metric: M2.5; Fastener Material: Stainless Steel; Screw Length: 6; Screw Head Style: Pan Head Pozidriv; SVHC: No SVHC (12-Jan-2017); Driver Type: Pozi; Thread Size: M2.5<!--FANDB--><div class="features-and-benefits-container"><div class="features-and-benefits-description"><span class="features-benefits-value">The M2.56 PRA2MCS100- is a M2.5 x 6mm Machine Screw, made of 18/8 stainless steel (A2 grade) with self colour finish, cross-recessed pan head Pozidriv head style. Designed according to DIN 7985 standard. Corrosion resistant under normal atmospheric conditions.</span></div><div class="features-and-benefits-list"><ul class="features-and-benefits-list-list"><li class="features-and-benefits-list-item">5; Supplier 1: Farnell; Supplier Part Number 1: 1420030; RoHS: YES; Stock 1: 256; Pricing 1: 100=0.0542, 10000=0.0503, 25000=0.0477, 50000=0.0467 (GBP); Thread Size - Imperial: -; Fastener Plating: -; Product Range: -; External Length / Height: 6; Material: Stainless Steel; ComponentLink1URL: http://www.farnell.com/datasheets/1661804.pdf; ComponentLink1Description: http://www.farnell.com/datasheets/1661804.pdf
R318 R319 = Res_0402: as R297 on sheet 22_USB3_0_device; Supplier 1: Digi-Key; Supplier Part Number 1: RMCF0402FT2K20CT-ND; Height: 0.016" (0.40mm); Tolerance: ±1%; Composition: Thick Film; Package / Case: 0402 (1005 Metric); Category: Resistors; Value: 2K2, 1%
R320 R321 R324-R326 = Res_0402: as R286 on sheet 22_USB3_0_device; Supplier 1: Digi-Key; Supplier Part Number 1: 311-0.0JRTR-ND; Composition: Thick Film; Package / Case: 0402 (1005 Metric); Category: Resistors; Value: 0R
R322 R323 = Res_0402: as R313 on sheet 22_USB3_0_device; Value: 0R; Supplier 1: Digi-Key; Supplier Part Number 1: 311-0.0JRTR-ND; Category: Resistors; Temperature Coefficient: -; Features: Moisture Resistant; Supplier Device Package: 0402; Height: 0.016" (0.40mm); Package / Case: 0402 (1005 Metric); Operating Temperature: -55°C ~ 155°C; Size / Dimension: 0.039" L x 0.020" W (1.00mm x 0.50mm); Composition: Thick Film; Packaging: Tape & Reel (TR); Number of Terminations: 2; RoHS: RoHS Compliant
VT14 VT15 = NDS331N: Part Description: MOSFET N-CH 20V 1.3A SSOT3; Manufacturer: Fairchild Semiconductor; Gate Charge (Qg) @ Vgs: 5nC @ 4.5V; Power - Max: 460mW; Current - Continuous Drain (Id) @ 25°C: 1.3A (Ta); Input Capacitance (Ciss) @ Vds: 162pF @ 10V; FET Type: MOSFET N-Channel, Metal Oxide; Drain to Source Voltage (Vdss): 20V; FET Feature: Logic Level Gate; Supplier Device Package: 3-SSOT; Category: Discrete Semiconductor Products; Mounting Type: Surface Mount; Package / Case: TO-236-3, SC-59, SOT-23-3; Supplier 1: Digi-Key; Supplier Part Number 1: NDS331NCT-ND; Manufacturer Part Number 1: NDS331N
  VT15: Manufacturer Part Number: NDS331N